# EAGLE design V-00808-00 (EAGLE 7.2.0)
AUTHOR: M. Petrilak; VERSION: 01

## Sheet 1 of 2
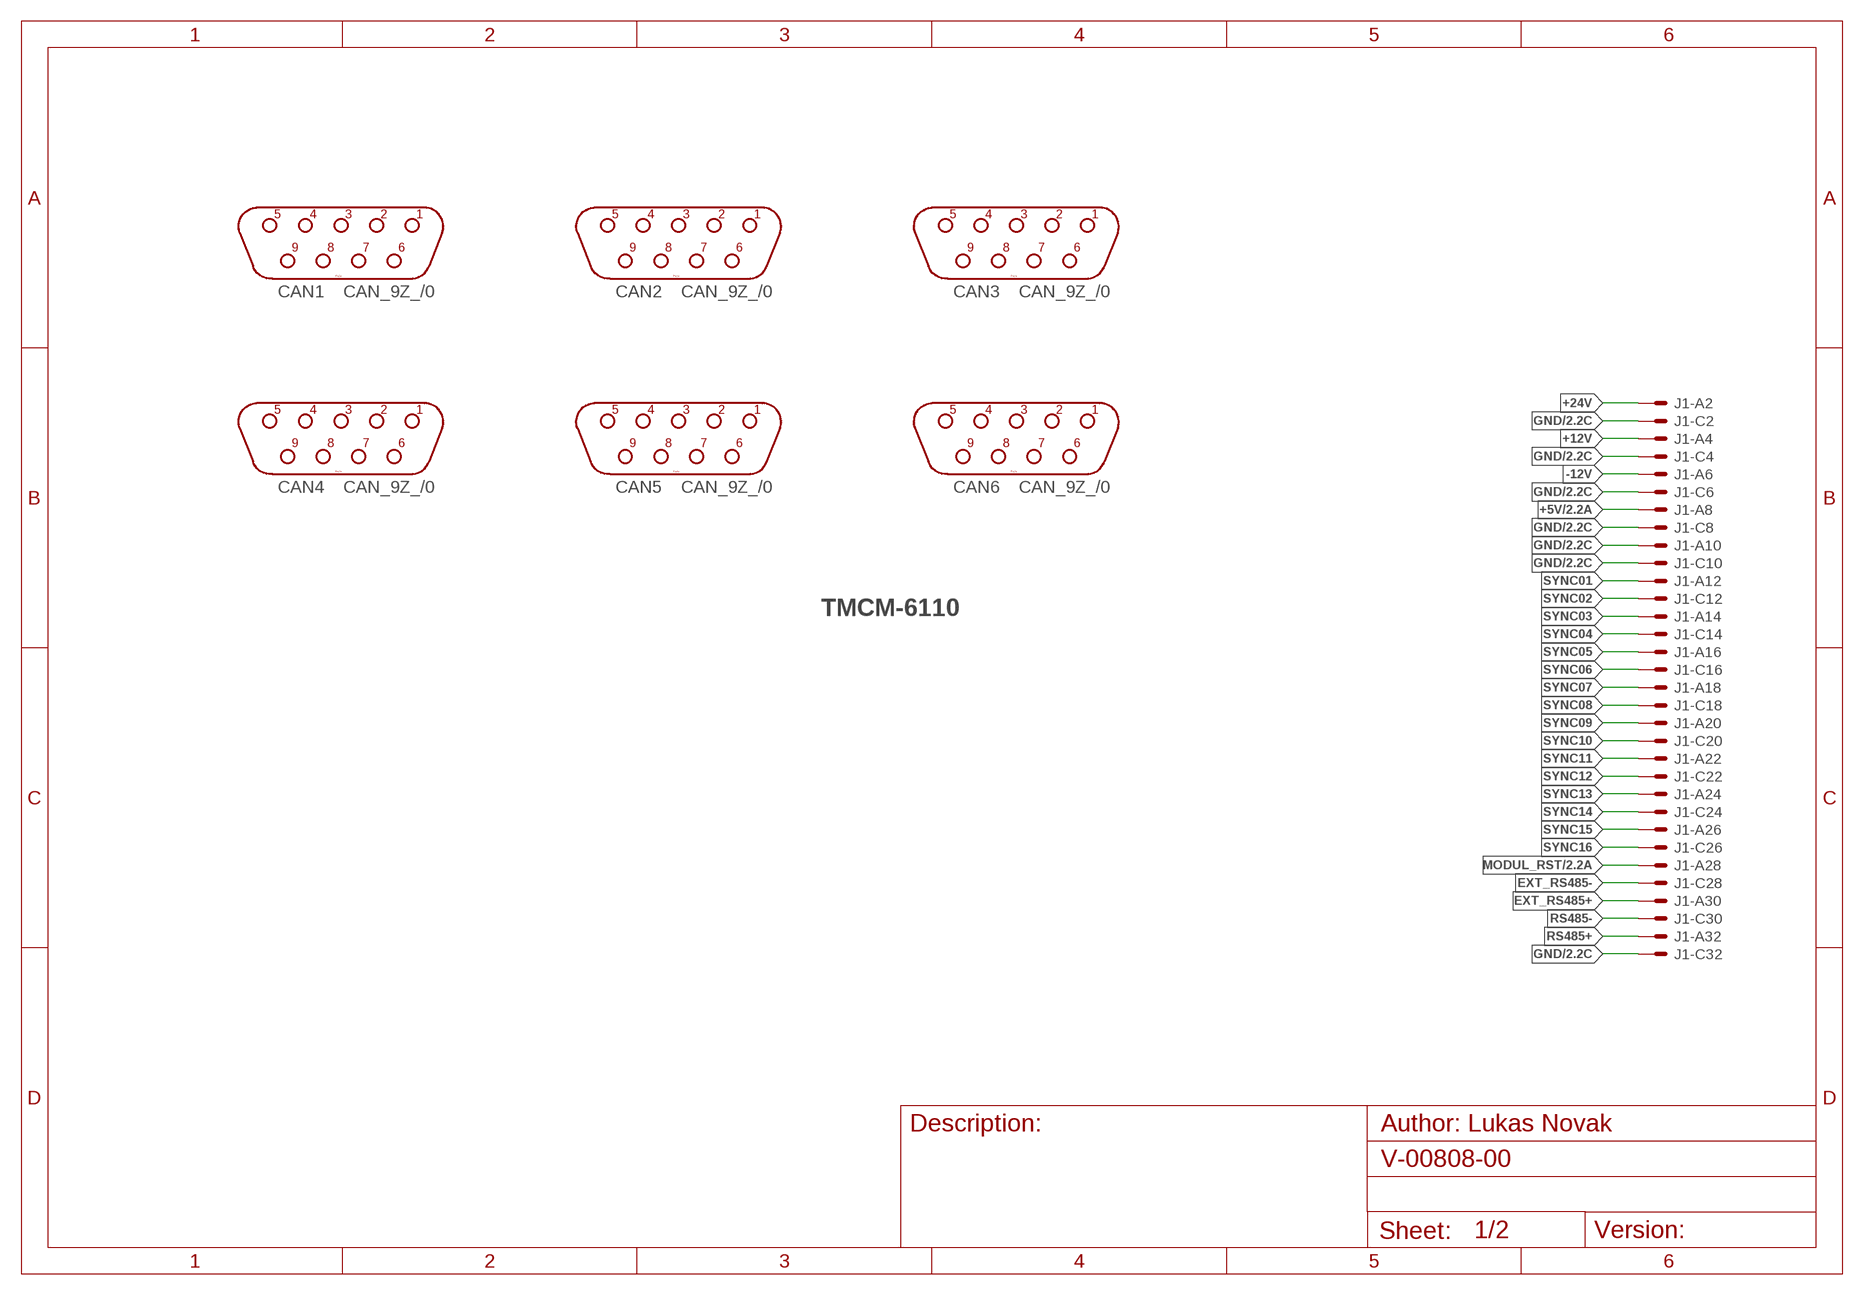
[diagram p0: schematic, sheet 1]

### Parts
CAN1  CAN_9Z_/0  [CAN9Z]
CAN2  CAN_9Z_/0  [CAN9Z]
CAN3  CAN_9Z_/0  [CAN9Z]
CAN4  CAN_9Z_/0  [CAN9Z]
CAN5  CAN_9Z_/0  [CAN9Z]
CAN6  CAN_9Z_/0  [CAN9Z]
J1  VG32SP  [VG32P]

### Nets
+5V: J1.A8 ; also sheet 2
+12V: J1.A4
+24V: J1.A2
-12V: J1.A6
EXT_RS485+: J1.A30
EXT_RS485-: J1.C28
GND: J1.A10 J1.C2 J1.C4 J1.C6 J1.C8 J1.C10 J1.C32 ; also sheet 2
MODUL_RST: J1.A28 ; also sheet 2
RS485+: J1.A32
RS485-: J1.C30
SYNC01: J1.A12
SYNC02: J1.C12
SYNC03: J1.A14
SYNC04: J1.C14
SYNC05: J1.A16
SYNC06: J1.C16
SYNC07: J1.A18
SYNC08: J1.C18
SYNC09: J1.A20
SYNC10: J1.C20
SYNC11: J1.A22
SYNC12: J1.C22
SYNC13: J1.A24
SYNC14: J1.C24
SYNC15: J1.A26
SYNC16: J1.C26
Unconnected: CAN1.1 CAN1.2 CAN1.3 CAN1.4 CAN1.5 CAN1.6 CAN1.7 CAN1.8 CAN1.9 CAN2.1 CAN2.2 CAN2.3 CAN2.4 CAN2.5 CAN2.6 CAN2.7 CAN2.8 CAN2.9 CAN3.1 CAN3.2 CAN3.3 CAN3.4 CAN3.5 CAN3.6 CAN3.7 CAN3.8 CAN3.9 CAN4.1 CAN4.2 CAN4.3 CAN4.4 CAN4.5 CAN4.6 CAN4.7 CAN4.8 CAN4.9 CAN5.1 CAN5.2 CAN5.3 CAN5.4 CAN5.5 CAN5.6 CAN5.7 CAN5.8 CAN5.9 CAN6.1 CAN6.2 CAN6.3 CAN6.4 CAN6.5 CAN6.6 CAN6.7 CAN6.8 CAN6.9

### Notes on the sheet
- TMCM-6110

## Sheet 2 of 2
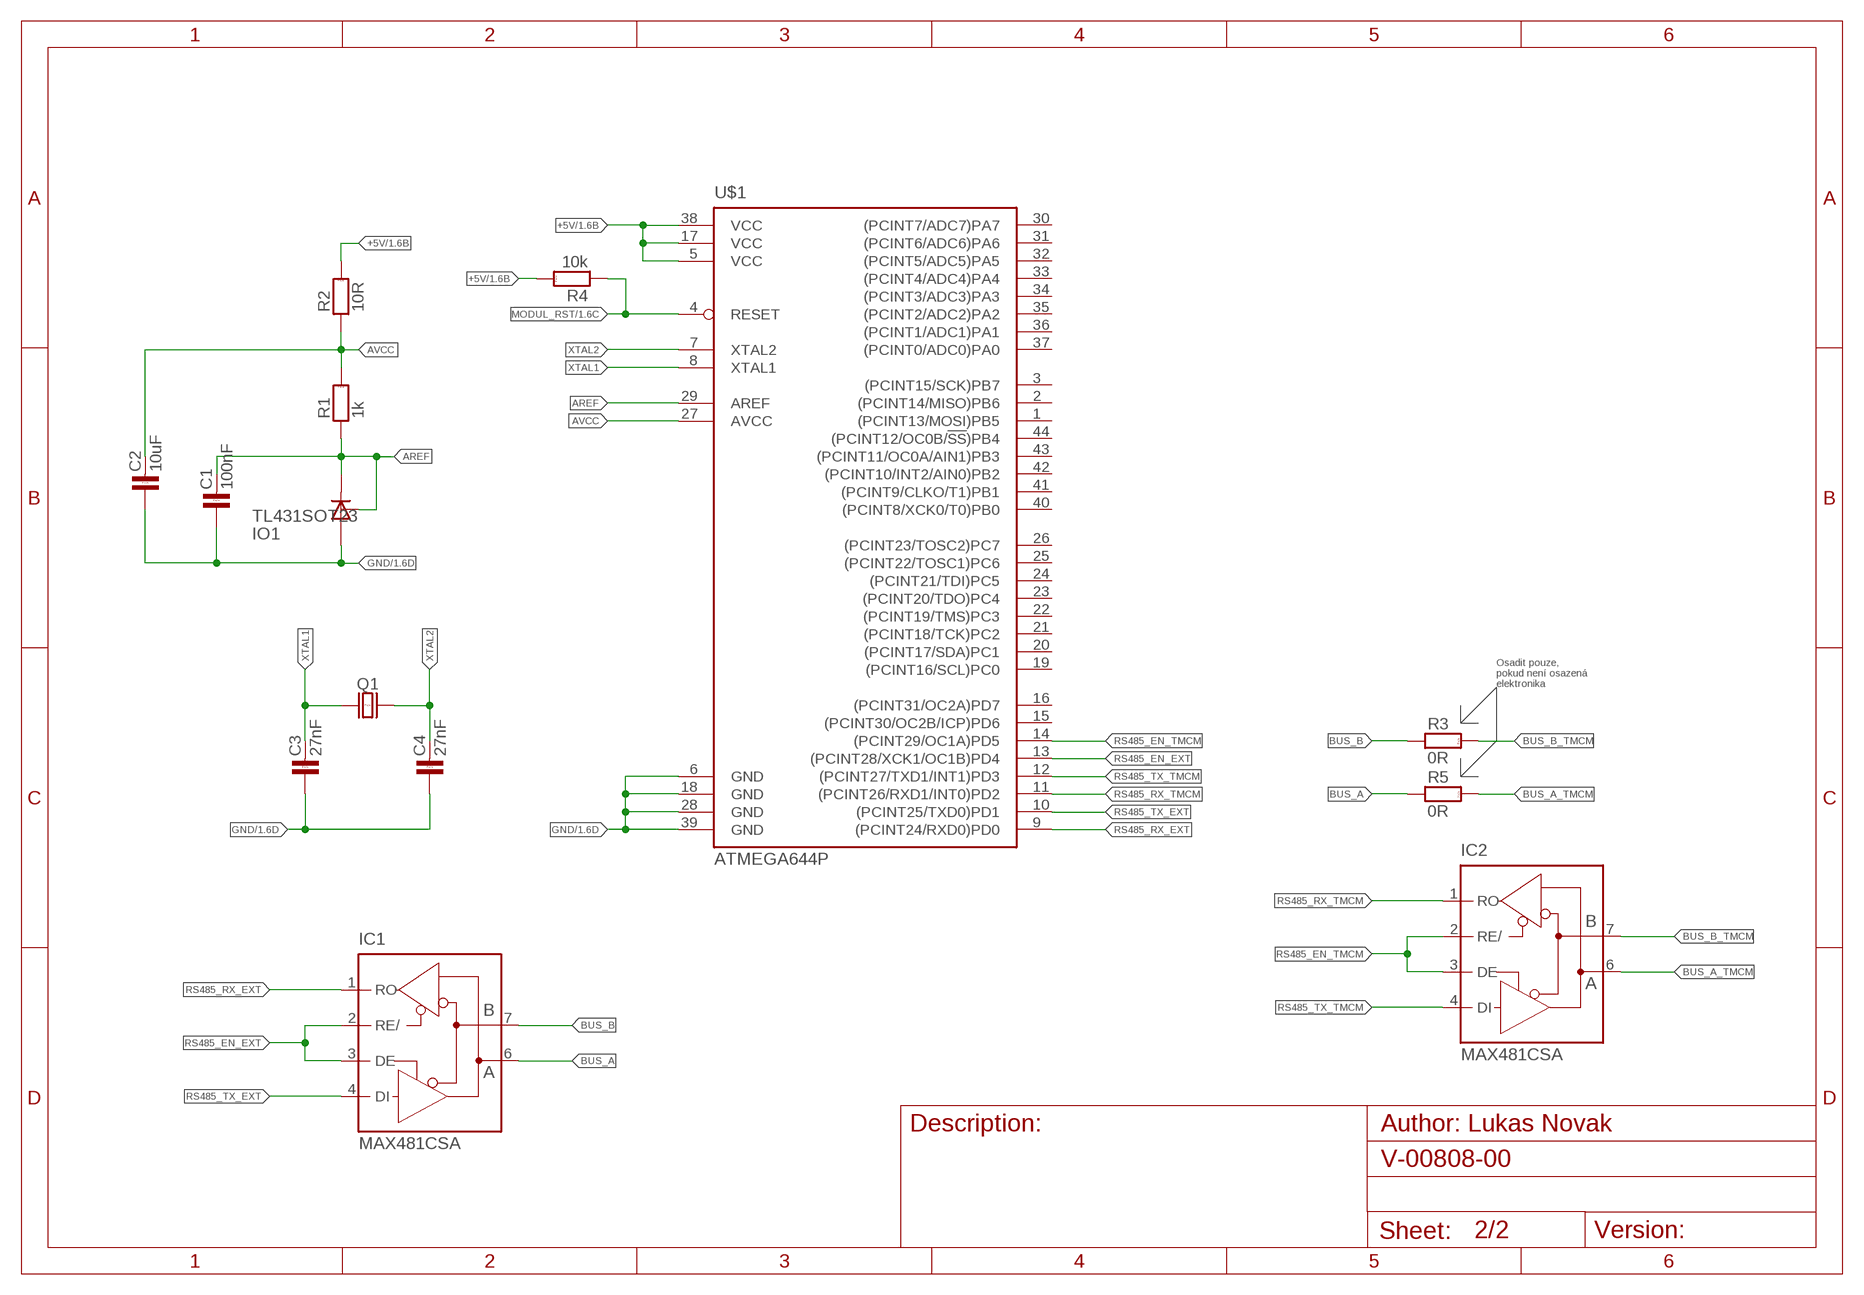
[diagram p1: schematic, sheet 2]

### Parts
C1  100nF  C-KER_1206  [1206]
C2  10uF  C-KER_1206  [1206]
C3  27nF  C-KER_0805  [0805]
C4  27nF  C-KER_0805  [0805]
IC1  MAX481CSA  [SO08]
IC2  MAX481CSA  [SO08]
IO1  TL431SOT23  [SOT23]
Q1  Q_HC-49U  [HC-49U]
R1  1k  R_1206  [1206]
R2  10R  R_1206  [1206]
R3  0R  R_1206  [1206]
R4  10k  R_1206  [1206]
R5  0R  R_1206  [1206]
U$1  ATMEGA644P  [TQFP44]

### Nets
+5V: R2.2 R4.2 U$1.5(VCC) U$1.17(VCC) U$1.38(VCC) ; also sheet 1
AREF: C1.2 IO1.1(C) IO1.2(R) R1.1 U$1.29(AREF)
AVCC: C2.2 R1.2 R2.1 U$1.27(AVCC)
BUS_A: IC1.6(A) R5.1
BUS_A_TMCM: IC2.6(A) R5.2
BUS_B: IC1.7(B) R3.1
BUS_B_TMCM: IC2.7(B) R3.2
GND: C1.1 C2.1 C3.1 C4.1 IO1.3(A) U$1.6(GND) U$1.18(GND) U$1.28(GND) U$1.39(GND) ; also sheet 1
MODUL_RST: R4.1 U$1.4(RESET) ; also sheet 1
RS485_EN_EXT: IC1.2(RE/) IC1.3(DE) U$1.13((PCINT28/XCK1/OC1B)PD4)
RS485_EN_TMCM: IC2.2(RE/) IC2.3(DE) U$1.14((PCINT29/OC1A)PD5)
RS485_RX_EXT: IC1.1(RO) U$1.9((PCINT24/RXD0)PD0)
RS485_RX_TMCM: IC2.1(RO) U$1.11((PCINT26/RXD1/INT0)PD2)
RS485_TX_EXT: IC1.4(DI) U$1.10((PCINT25/TXD0)PD1)
RS485_TX_TMCM: IC2.4(DI) U$1.12((PCINT27/TXD1/INT1)PD3)
XTAL1: C3.2 Q1.1 U$1.8(XTAL1)
XTAL2: C4.2 Q1.2 U$1.7(XTAL2)
Unconnected: U$1.1((PCINT13/MOSI)PB5) U$1.2((PCINT14/MISO)PB6) U$1.3((PCINT15/SCK)PB7) U$1.15((PCINT30/OC2B/ICP)PD6) U$1.16((PCINT31/OC2A)PD7) U$1.19((PCINT16/SCL)PC0) U$1.20((PCINT17/SDA)PC1) U$1.21((PCINT18/TCK)PC2) U$1.22((PCINT19/TMS)PC3) U$1.23((PCINT20/TDO)PC4) U$1.24((PCINT21/TDI)PC5) U$1.25((PCINT22/TOSC1)PC6) U$1.26((PCINT23/TOSC2)PC7) U$1.30((PCINT7/ADC7)PA7) U$1.31((PCINT6/ADC6)PA6) U$1.32((PCINT5/ADC5)PA5) U$1.33((PCINT4/ADC4)PA4) U$1.34((PCINT3/ADC3)PA3) U$1.35((PCINT2/ADC2)PA2) U$1.36((PCINT1/ADC1)PA1) U$1.37((PCINT0/ADC0)PA0) U$1.40((PCINT8/XCK0/T0)PB0) U$1.41((PCINT9/CLKO/T1)PB1) U$1.42((PCINT10/INT2/AIN0)PB2) U$1.43((PCINT11/OC0A/AIN1)PB3) U$1.44((PCINT12/OC0B/!SS!)PB4)

### Notes on the sheet
- Osadit pouze,
  pokud není osazená
  elektronika

## Power pins joined to a net without a drawn wire
GND: IC1.5(GND) IC2.5(GND)
VCC: IC1.8(VCC) IC2.8(VCC)

## Library data of the parts
C1-C4 = #PaJa_31:C-KER: Kondenzator - keramicky
CAN1-CAN6 = #PaJa_konektory:CAN_9Z: Konektory CANNON - zasuvka - 9pinu
IC1 IC2 = maxim:MAX481CSA: RS485 TRANSEIVER; MF: MAXIM; MPN: MAX481CSA; OC_FARNELL: unknown; OC_NEWARK: 90C3817
IO1 = references:TL431: Programmable Shunt Regulator TL431 Features > Programmable Output Voltage to 36 Volts > Low Dynamic Output Impedance 0.2? Typical > Sink Current Capability of 1.0 to 100mA > Equivalent Full-Range Temperature Coefficient of 50ppm/°C Typical > Temperature Compensated For Operation Over Full Rated Operating Temperature Range > Low Output Noise Voltage > Fast Turn-on Response; MPN: TL431BFDT; OC_FARNELL: 2095471; PACKAGE: SOT23; SUPPLIER: NXP
J1 = 19inch:VG32S: PCB EUROCARD, 32-pin type C/AC, 5.08 mm
Q1 = #PaJa_31:Q: Krystal HC-49 - 1MHz - 48MHz DT38 - Quartz (hodinovy) 32,768kHz
R1-R5 = #PaJa_31:R: Rezistor
U$1 = atmel:ATMEGA644P

## Board
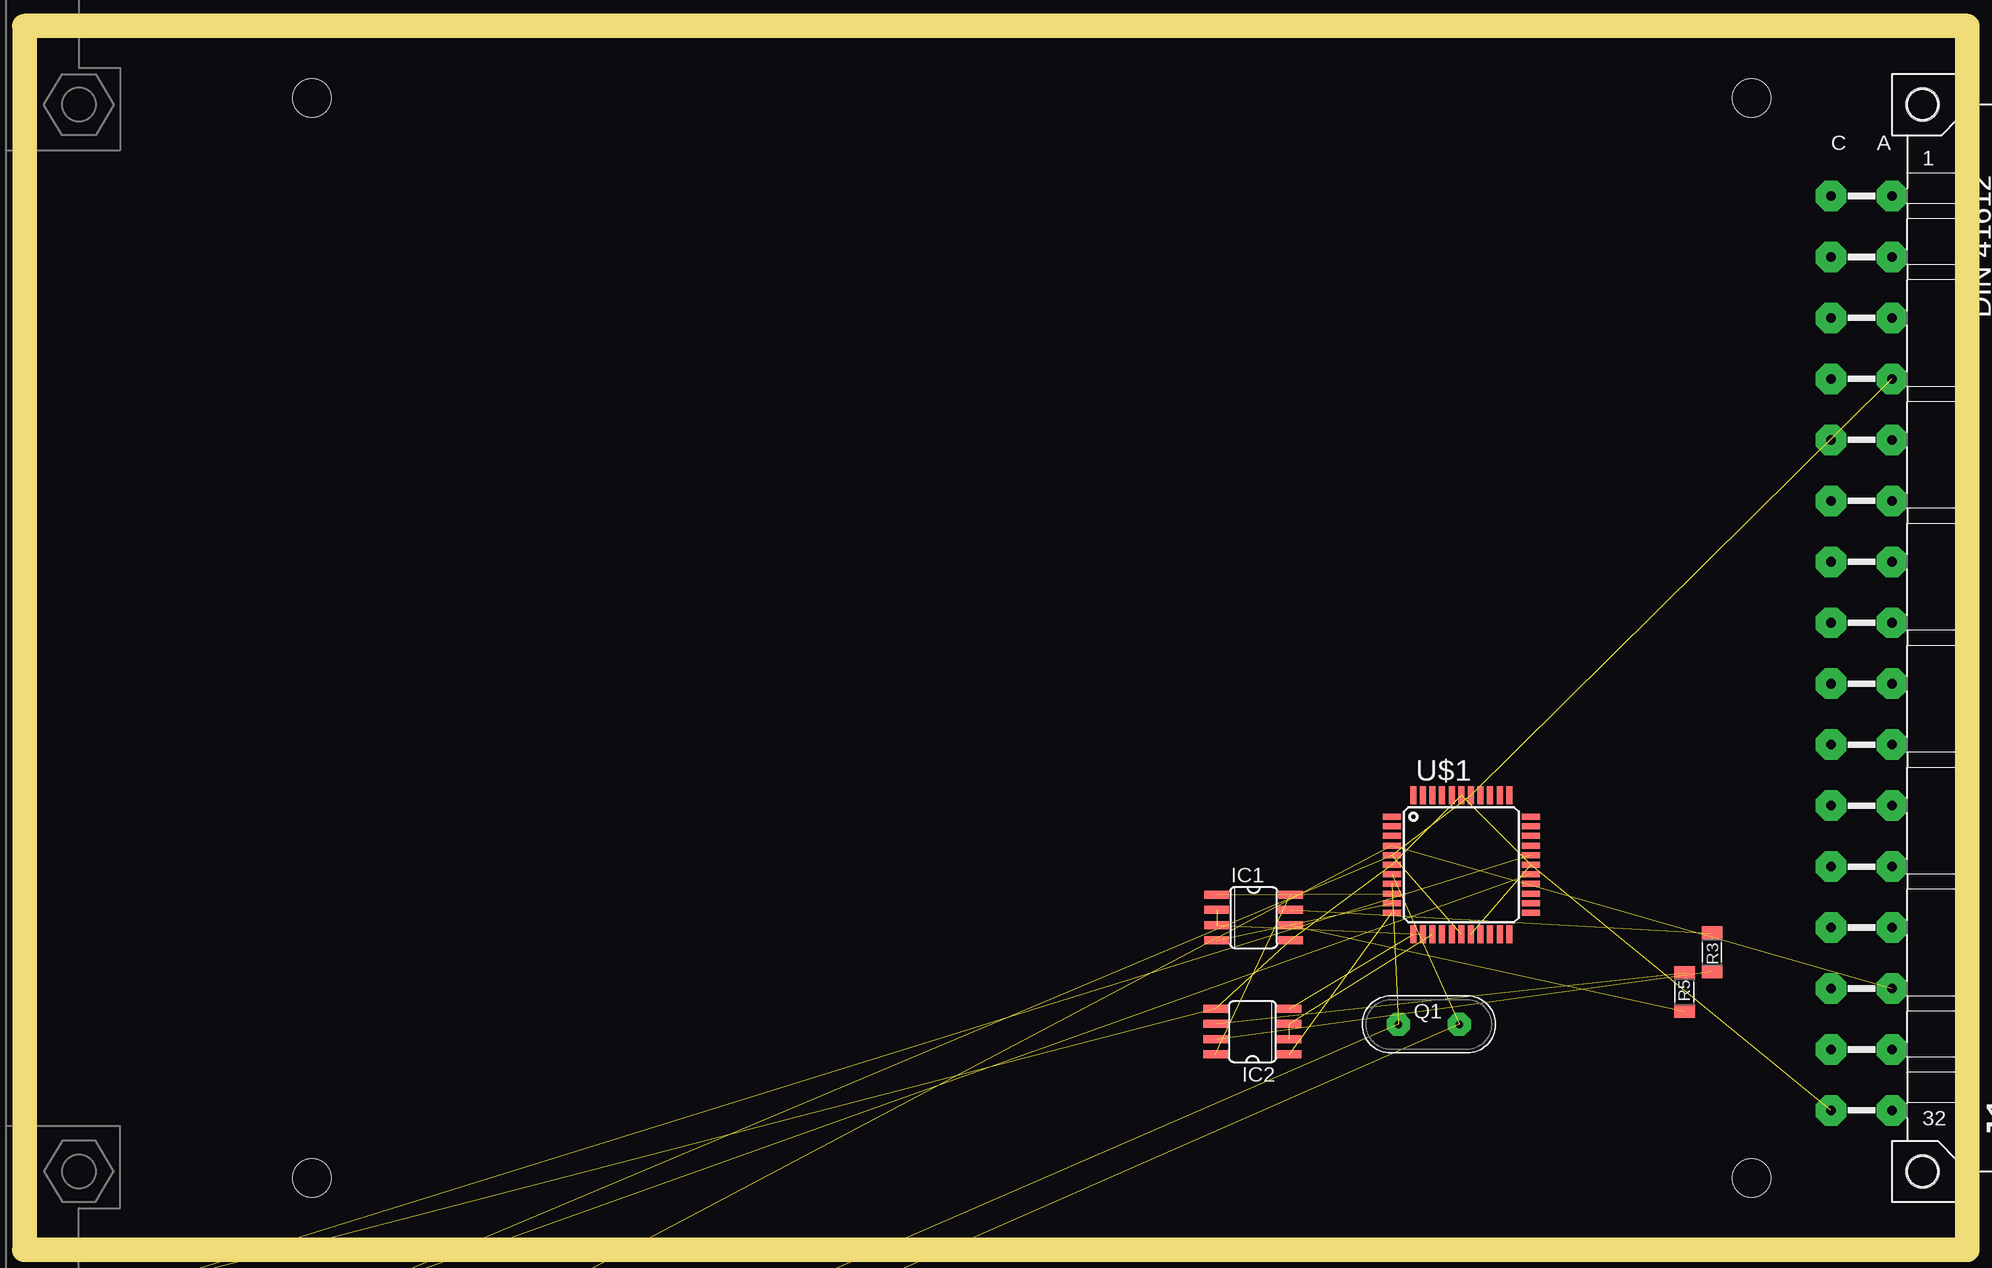
[diagram p2: board, top side]
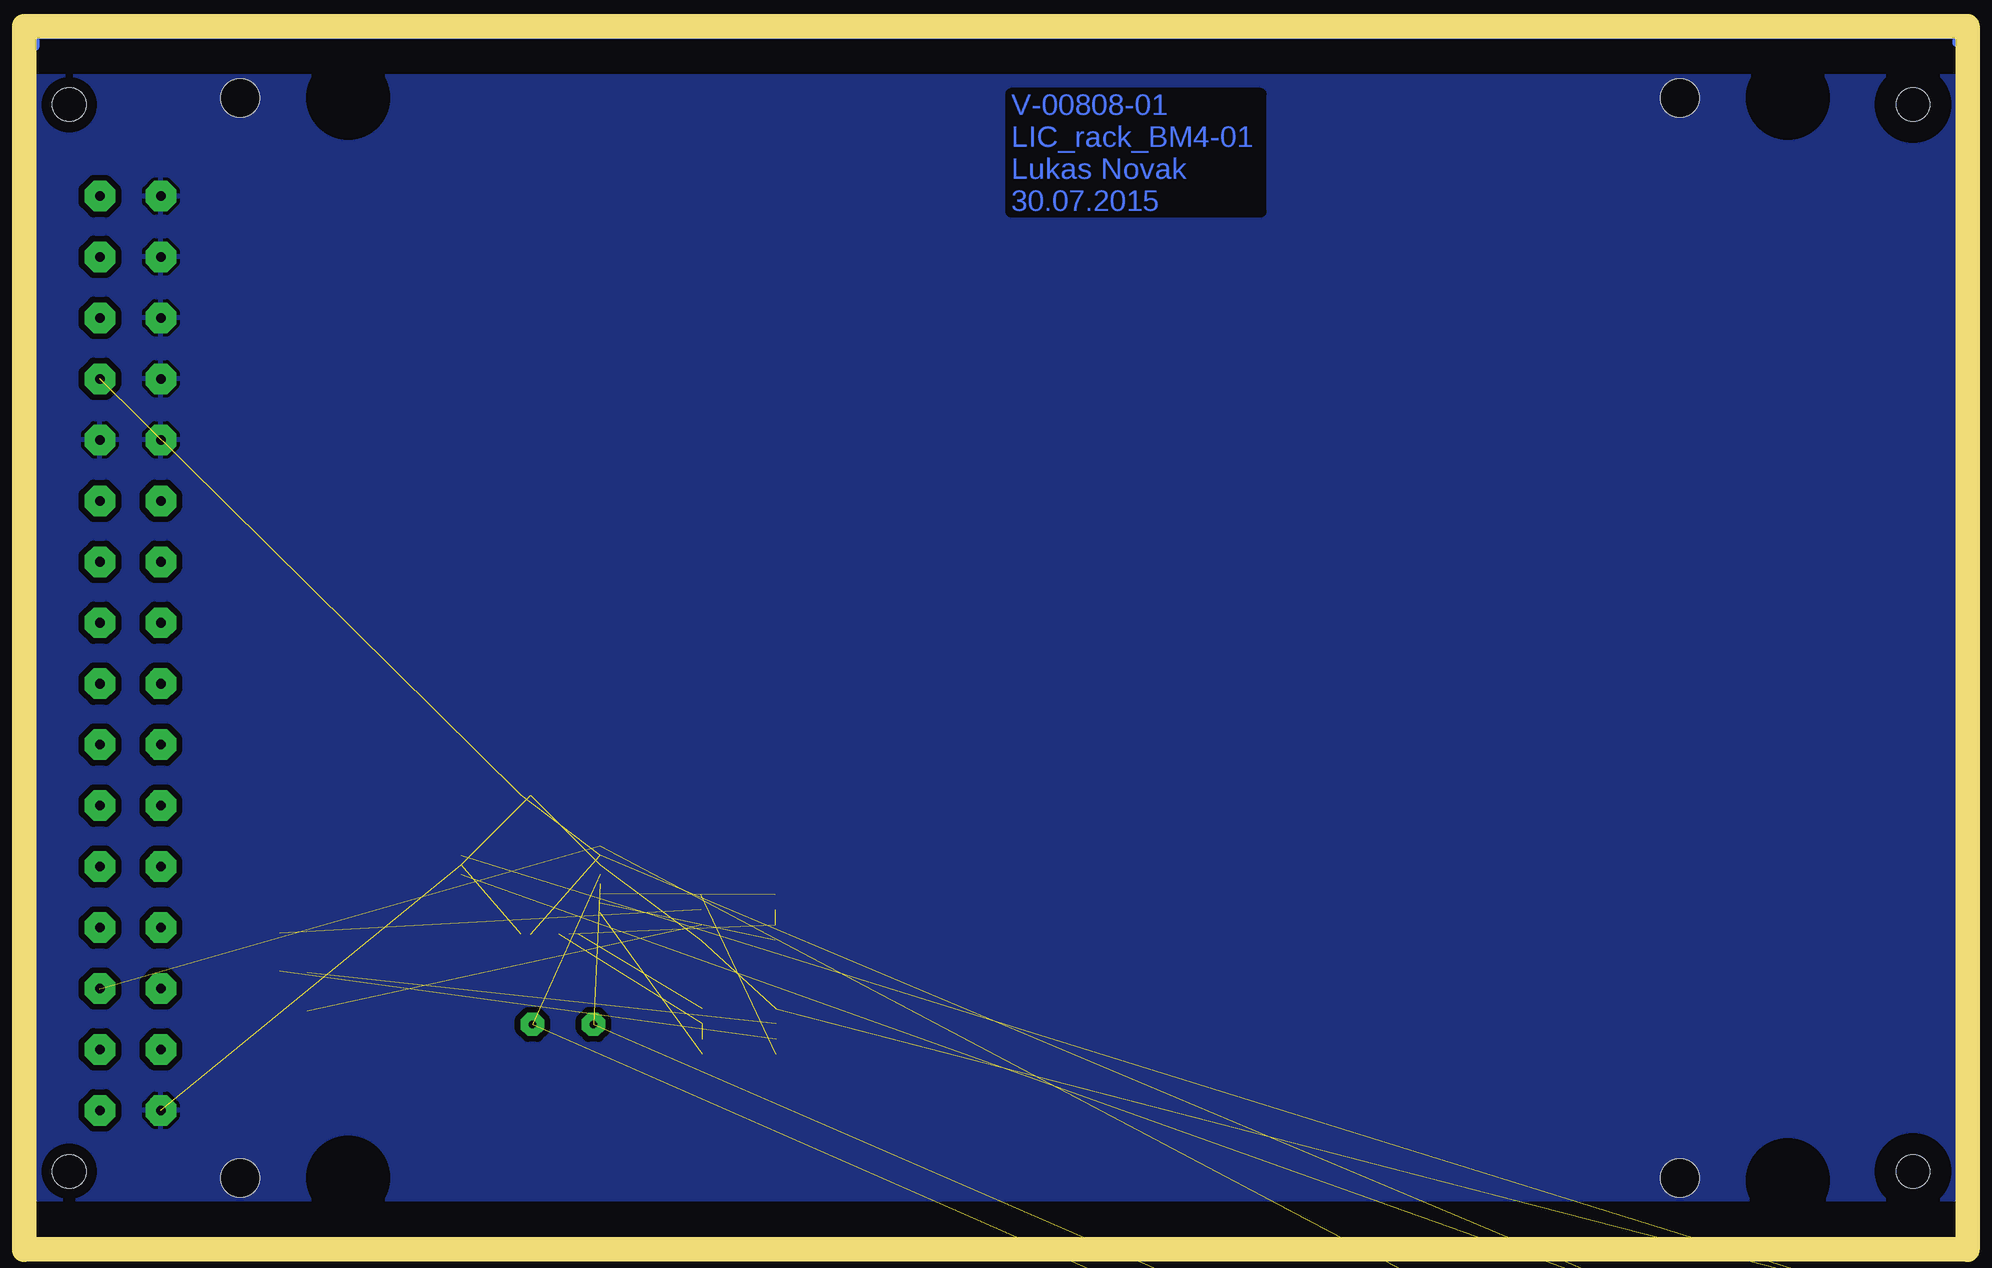
[diagram p3: board, bottom side, seen from below]

Size 160 x 100 mm. Coordinates in mm from the lower left corner, seen from the top.
Copper layers (1*16): Top 0.04mm / dielectric 1.5mm / Bottom 0.04mm
Design rules "Michal_mid *": minimum track width 0.2mm, minimum drill 0.6mm, track to track 0.5mm, track to pad 0.5mm, pad to pad 0.3mm, via to via 0.3mm, smd to smd 0mil, copper to edge 0.0001mm, drill to drill 0.2mm, minimum pad ring 0.3mm, minimum via ring 0.3mm, stop-mask expansion 0.1mm, vias tented up to drill 0.5mm, thermal gap 0.3mm
Holes 3.2 mm at 23,95 23,5 143,95 143,5
bRestrict: area 10.5,91.5 to 17.5,98.5; area 130.5,91.5 to 137.5,98.5; area 10.5,1.3 to 17.5,8.3; area 130.5,1.5 to 137.5,8.5

### Footprints (pad centres in the part's own frame; a part is rotated, then mirrored left to right if it is on the bottom)
1206 = smd 1.143 x 1.702: 1 -1.587,0; 2 1.587,0
0805 = smd 1.016 x 1.422: 1 -0.953,0; 2 0.953,0
CAN9Z = drill 1.016 pad 1.93 octagon: 1 5.715,0; 2 2.857,0; 3 0,0; 4 -2.857,0; 5 -5.715,0; 6 4.286,-2.857; 7 1.429,-2.857; 8 -1.429,-2.857; 9 -4.286,-2.857 | hole 4.115: 12.192,-1.429; -12.192,-1.429
SO08 = smd 0.66 x 2.032: 1 -1.905,-3.073; 2 -0.635,-3.073; 3 0.635,-3.073; 4 1.905,-3.073; 5 1.905,3.073; 6 0.635,3.073; 7 -0.635,3.073; 8 -1.905,3.073
SOT23 = smd 1 x 1.4: 1 -0.95,-1.1; 2 0.95,-1.1; 3 0,1.1
VG32P = drill 0.8 pad 2.54 octagon: A2 154.7,36.83; A4 154.7,31.75; A6 154.7,26.67; A8 154.7,21.59; A10 154.7,16.51; A12 154.7,11.43; A14 154.7,6.35; A16 154.7,1.27; A18 154.7,-3.81; A20 154.7,-8.89; A22 154.7,-13.97; A24 154.7,-19.05; A26 154.7,-24.13; A28 154.7,-29.21; A30 154.7,-34.29; A32 154.7,-39.37; C2 149.62,36.83; C4 149.62,31.75; C6 149.62,26.67; C8 149.62,21.59; C10 149.62,16.51; C12 149.62,11.43; C14 149.62,6.35; C16 149.62,1.27; C18 149.62,-3.81; C20 149.62,-8.89; C22 149.62,-13.97; C24 149.62,-19.05; C26 149.62,-24.13; C28 149.62,-29.21; C30 149.62,-34.29; C32 149.62,-39.37 | hole 2.794: 3.57,44.45; 3.57,-44.45; 157.24,44.45; 157.24,-44.45
HC-49U = drill 0.61 pad 1.93 octagon: 1 -2.54,0; 2 2.54,0
TQFP44 = smd 1.5 x 0.5: 1 -5.8,4; 2 -5.8,3.2; 3 -5.8,2.4; 4 -5.8,1.6; 5 -5.8,0.8; 6 -5.8,0; 7 -5.8,-0.8; 8 -5.8,-1.6; 9 -5.8,-2.4; 10 -5.8,-3.2; 11 -5.8,-4; 23 5.8,-4; 24 5.8,-3.2; 25 5.8,-2.4; 26 5.8,-1.6; 27 5.8,-0.8; 28 5.8,0; 29 5.8,0.8; 30 5.8,1.6; 31 5.8,2.4; 32 5.8,3.2; 33 5.8,4 | smd 0.5 x 1.5: 12 -4,-5.8; 13 -3.2,-5.8; 14 -2.4,-5.8; 15 -1.6,-5.8; 16 -0.8,-5.8; 17 0,-5.8; 18 0.8,-5.8; 19 1.6,-5.8; 20 2.4,-5.8; 21 3.2,-5.8; 22 4,-5.8; 34 4,5.8; 35 3.2,5.8; 36 2.4,5.8; 37 1.6,5.8; 38 0.8,5.8; 39 0,5.8; 40 -0.8,5.8; 41 -1.6,5.8; 42 -2.4,5.8; 43 -3.2,5.8; 44 -4,5.8

### Placement (x,y rotation side)
C1  -41.1,-24.1 0 top  (outside the outline)
C2  -41.1,-36.4 0 top  (outside the outline)
C3  -41.5,-49.1 0 top  (outside the outline)
C4  -41.5,-52.1 0 top  (outside the outline)
CAN1  -13.1,82.4 90 top  (outside the outline)
CAN2  -13,50.3 90 top  (outside the outline)
CAN3  -12.9,17.7 90 top  (outside the outline)
CAN4  -28,82.5 90 top  (outside the outline)
CAN5  -28.1,50.2 90 top  (outside the outline)
CAN6  -28.1,17.7 90 top  (outside the outline)
IC1  101.5,26.7 270 top
IC2  101.4,17.2 90 top
IO1  -41,-18.1 0 top  (outside the outline)
J1  0,50 0 top
Q1  116.1,17.8 0 top
R1  -41.1,-28.2 0 top  (outside the outline)
R2  -41.1,-32.3 0 top  (outside the outline)
R3  139.7,23.8 270 top
R4  -54.4,-56.6 0 top  (outside the outline)
R5  137.4,20.5 90 top
U$1  118.8,31.1 0 top

### Tracks (layer width: path | path; a pad name or v marks a point on that pad's centre or on a via)
+5V  (5 unrouted)
AREF  (4 unrouted)
AVCC  (3 unrouted)
BUS_A  (1 unrouted)
BUS_A_TMCM  (1 unrouted)
BUS_B  (1 unrouted)
BUS_B_TMCM  (1 unrouted)
GND  (11 unrouted)
  pour Bottom: 0,0 160,0 160,100 0,100
MODUL_RST  (2 unrouted)
N$4
  Bottom 0.5: 160.02,99.21 160.02,100.16 0,100.16 0,99.53
RS485_EN_EXT  (2 unrouted)
RS485_EN_TMCM  (2 unrouted)
RS485_RX_EXT  (1 unrouted)
RS485_RX_TMCM  (1 unrouted)
RS485_TX_EXT  (1 unrouted)
RS485_TX_TMCM  (1 unrouted)
VCC  (1 unrouted)
XTAL1  (2 unrouted)
XTAL2  (2 unrouted)

### Text on the board
Bottom: V-00808-01 / LIC_rack_BM4-01 / Lukas Novak / 30.07.2015